# EAGLE schematic Filters_3Stage_Circuit_Manual (EAGLE 9.3.0)
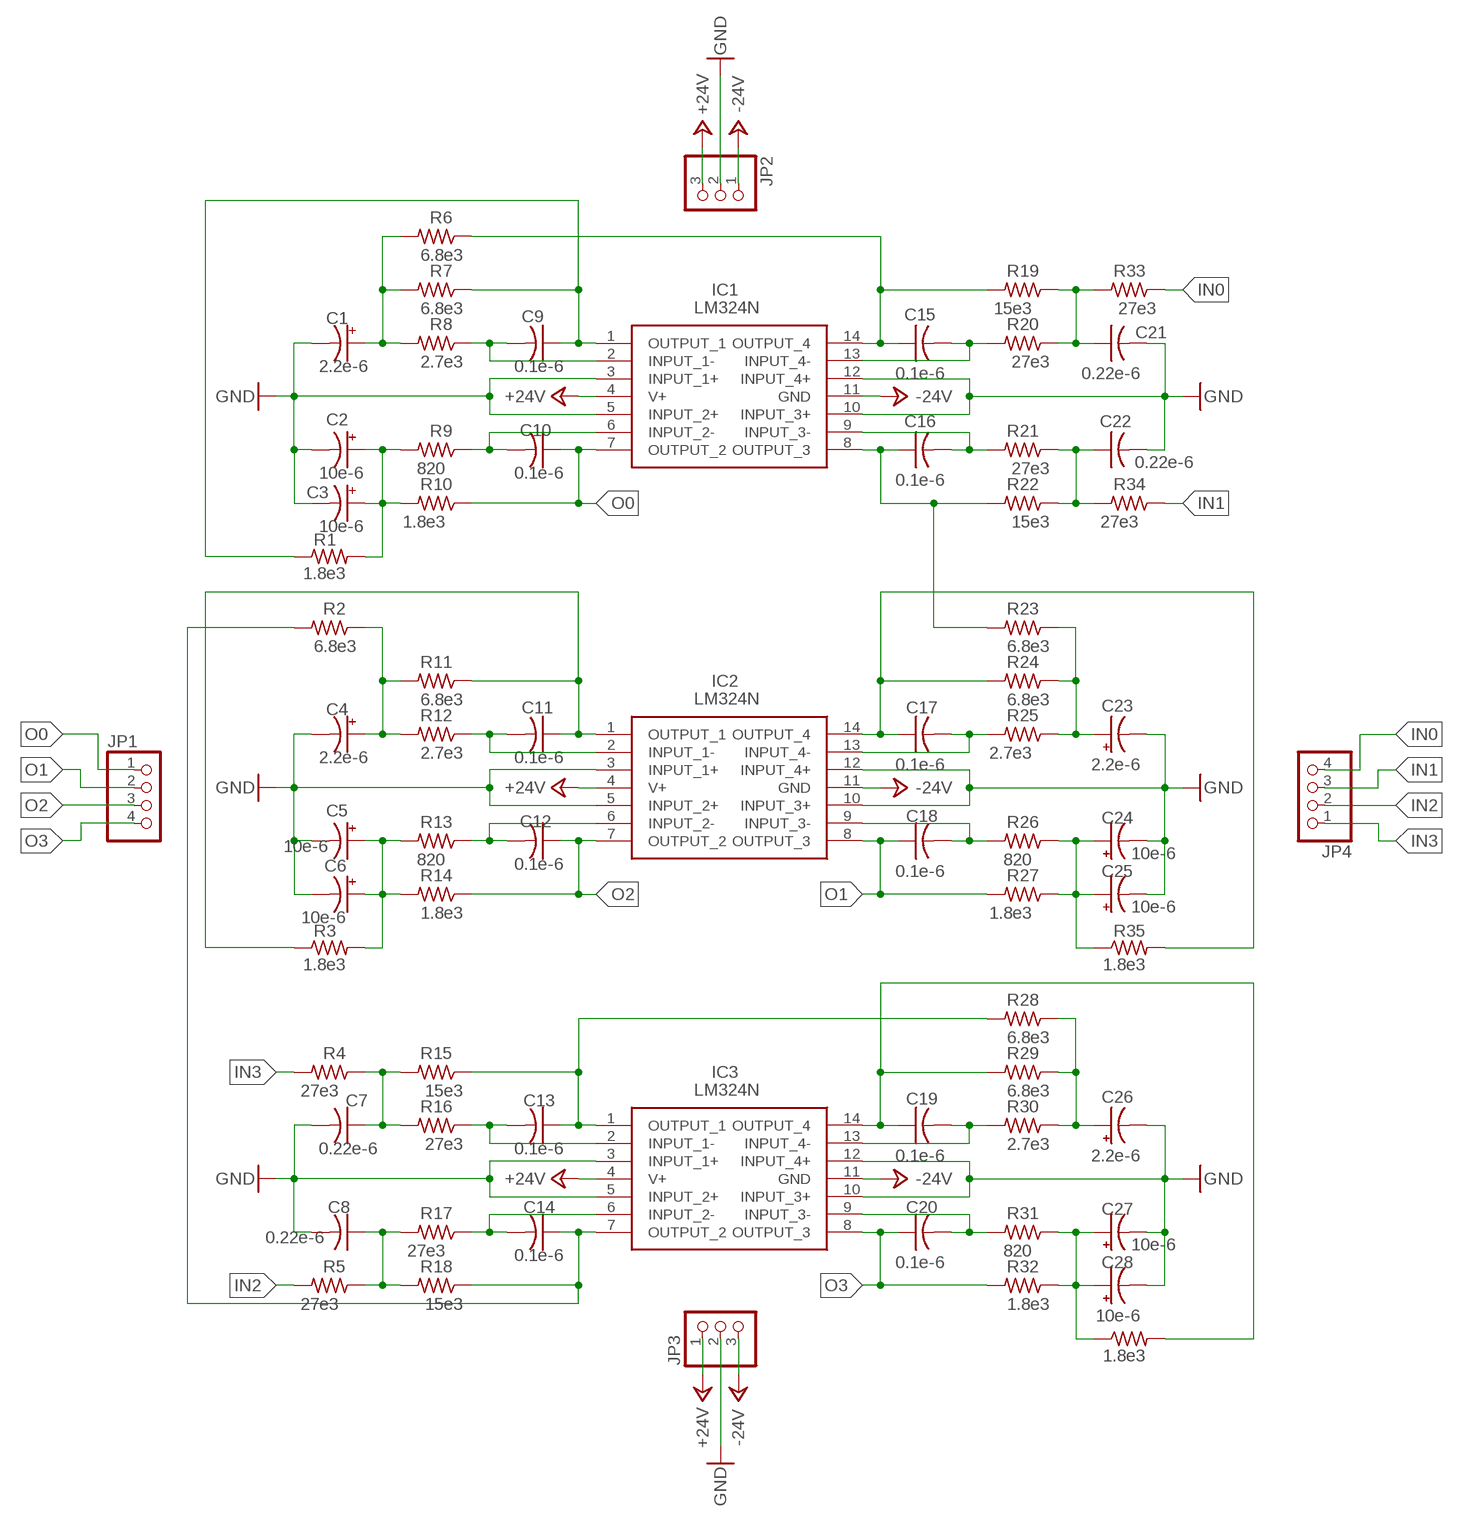
[diagram p0: schematic, sheet 1]

## Parts
C1  2.2e-6  CPOL-USE2.5-5  [E2,5-5]
C2  10e-6  CPOL-USE2.5-7  [E2,5-7]
C3  10e-6  CPOL-USE2.5-7  [E2,5-7]
C4  2.2e-6  CPOL-USE2.5-5  [E2,5-5]
C5  10e-6  CPOL-USE2.5-7  [E2,5-7]
C6  10e-6  CPOL-USE2.5-7  [E2,5-7]
C7  0.22e-6  C-US050-030X075  [C050-030X075]
C8  0.22e-6  C-US050-030X075  [C050-030X075]
C9  0.1e-6  C-US050-030X075  [C050-030X075]
C10  0.1e-6  C-US050-030X075  [C050-030X075]
C11  0.1e-6  C-US050-030X075  [C050-030X075]
C12  0.1e-6  C-US050-030X075  [C050-030X075]
C13  0.1e-6  C-US050-030X075  [C050-030X075]
C14  0.1e-6  C-US050-030X075  [C050-030X075]
C15  0.1e-6  C-US050-030X075  [C050-030X075]
C16  0.1e-6  C-US050-030X075  [C050-030X075]
C17  0.1e-6  C-US050-030X075  [C050-030X075]
C18  0.1e-6  C-US050-030X075  [C050-030X075]
C19  0.1e-6  C-US050-030X075  [C050-030X075]
C20  0.1e-6  C-US050-030X075  [C050-030X075]
C21  0.22e-6  C-US050-030X075  [C050-030X075]
C22  0.22e-6  C-US050-030X075  [C050-030X075]
C23  2.2e-6  CPOL-USE2.5-5  [E2,5-5]
C24  10e-6  CPOL-USE2.5-7  [E2,5-7]
C25  10e-6  CPOL-USE2.5-7  [E2,5-7]
C26  2.2e-6  CPOL-USE2.5-5  [E2,5-5]
C27  10e-6  CPOL-USE2.5-7  [E2,5-7]
C28  10e-6  CPOL-USE2.5-7  [E2,5-7]
IC1  LM324N  [DIP794W56P254L1905H533Q14N]
IC2  LM324N  [DIP794W56P254L1905H533Q14N]
IC3  LM324N  [DIP794W56P254L1905H533Q14N]
JP1  PINHD-1X4  [1X04]
JP2  PINHD-1X3  [1X03]
JP3  PINHD-1X3  [1X03]
JP4  PINHD-1X4  [1X04]
R1  1.8e3  R-US_0207/10  [0207/10]
R2  6.8e3  R-US_0207/10  [0207/10]
R3  1.8e3  R-US_0207/10  [0207/10]
R4  27e3  R-US_0207/10  [0207/10]
R5  27e3  R-US_0207/10  [0207/10]
R6  6.8e3  R-US_0207/10  [0207/10]
R7  6.8e3  R-US_0207/10  [0207/10]
R8  2.7e3  R-US_0207/10  [0207/10]
R9  820  R-US_0207/10  [0207/10]
R10  1.8e3  R-US_0207/10  [0207/10]
R11  6.8e3  R-US_0207/10  [0207/10]
R12  2.7e3  R-US_0207/10  [0207/10]
R13  820  R-US_0207/10  [0207/10]
R14  1.8e3  R-US_0207/10  [0207/10]
R15  15e3  R-US_0207/10  [0207/10]
R16  27e3  R-US_0207/10  [0207/10]
R17  27e3  R-US_0207/10  [0207/10]
R18  15e3  R-US_0207/10  [0207/10]
R19  15e3  R-US_0207/10  [0207/10]
R20  27e3  R-US_0207/10  [0207/10]
R21  27e3  R-US_0207/10  [0207/10]
R22  15e3  R-US_0207/10  [0207/10]
R23  6.8e3  R-US_0207/10  [0207/10]
R24  6.8e3  R-US_0207/10  [0207/10]
R25  2.7e3  R-US_0207/10  [0207/10]
R26  820  R-US_0207/10  [0207/10]
R27  1.8e3  R-US_0207/10  [0207/10]
R28  6.8e3  R-US_0207/10  [0207/10]
R29  6.8e3  R-US_0207/10  [0207/10]
R30  2.7e3  R-US_0207/10  [0207/10]
R31  820  R-US_0207/10  [0207/10]
R32  1.8e3  R-US_0207/10  [0207/10]
R33  27e3  R-US_0207/10  [0207/10]
R34  27e3  R-US_0207/10  [0207/10]
R35  1.8e3  R-US_0207/10  [0207/10]
R36  1.8e3  R-US_0207/10  [0207/10]

## Nets
+24V: IC1.4(V+) IC2.4(V+) IC3.4(V+) JP2.3 JP3.1
-24V: IC1.11(GND) IC2.11(GND) IC3.11(GND) JP2.1 JP3.3
GND: C1.- C2.- C3.- C4.- C5.- C6.- C7.2 C8.2 C21.2 C22.2 C23.- C24.- C25.- C26.- C27.- C28.- IC1.3(INPUT_1+) IC1.5(INPUT_2+) IC1.10(INPUT_3+) IC1.12(INPUT_4+) IC2.3(INPUT_1+) IC2.5(INPUT_2+) IC2.10(INPUT_3+) IC2.12(INPUT_4+) IC3.3(INPUT_1+) IC3.5(INPUT_2+) IC3.10(INPUT_3+) IC3.12(INPUT_4+) JP2.2 JP3.2
IN0: JP4.4 R33.1
IN1: JP4.3 R34.1
IN2: JP4.2 R5.2
IN3: JP4.1 R4.2
N$216: C15.1 IC1.14(OUTPUT_4) R6.1 R19.2
N$217: C15.2 IC1.13(INPUT_4-) R20.2
N$218: C21.1 R19.1 R20.1 R33.2
N$219: C9.1 IC1.1(OUTPUT_1) R1.1 R7.1
N$221: C9.2 IC1.2(INPUT_1-) R8.1
N$223: C10.2 IC1.6(INPUT_2-) R9.1
N$224: C1.+ R6.2 R7.2 R8.2
N$225: C2.+ C3.+ R1.2 R9.2 R10.2
N$226: C16.1 IC1.8(OUTPUT_3) R22.2 R23.2
N$227: C16.2 IC1.9(INPUT_3-) R21.2
N$228: C22.1 R21.1 R22.1 R34.2
N$229: C17.1 IC2.14(OUTPUT_4) R24.2 R35.2
N$230: C17.2 IC2.13(INPUT_4-) R25.2
N$231: C23.+ R23.1 R24.1 R25.1
N$234: C11.1 IC2.1(OUTPUT_1) R3.1 R11.1
N$235: C11.2 IC2.2(INPUT_1-) R12.1
N$236: C4.+ R2.1 R11.2 R12.2
N$238: C12.2 IC2.6(INPUT_2-) R13.1
N$239: C5.+ C6.+ R3.2 R13.2 R14.2
N$240: C18.2 IC2.9(INPUT_3-) R26.2
N$241: C24.+ C25.+ R26.1 R27.1 R35.1
N$243: C13.2 IC3.2(INPUT_1-) R16.1
N$244: C14.1 IC3.7(OUTPUT_2) R2.2 R18.1
N$245: C14.2 IC3.6(INPUT_2-) R17.1
N$246: C7.1 R4.1 R15.2 R16.2
N$249: C8.1 R5.1 R17.2 R18.2
N$250: C13.1 IC3.1(OUTPUT_1) R15.1 R28.2
N$251: C19.1 IC3.14(OUTPUT_4) R29.2 R36.2
N$252: C19.2 IC3.13(INPUT_4-) R30.2
N$253: C26.+ R28.1 R29.1 R30.1
N$255: C20.2 IC3.9(INPUT_3-) R31.2
N$256: C27.+ C28.+ R31.1 R32.1 R36.1
O0: C10.1 IC1.7(OUTPUT_2) JP1.1 R10.1
O1: C18.1 IC2.8(OUTPUT_3) JP1.2 R27.2
O2: C12.1 IC2.7(OUTPUT_2) JP1.3 R14.1
O3: C20.1 IC3.8(OUTPUT_3) JP1.4 R32.2

## Library data of the parts
C1-C6 C23-C28 = rcl:CPOL-US: POLARIZED CAPACITOR, American symbol; SPICEPREFIX: C
C7-C22 = adafruit:C-US: CAPACITOR, American symbol
IC1-IC3 = SamacSys_Parts:LM324N: OP Amp Quad GP 16V/32V 14-Pin PDIP Texas Instruments LM324N, Quad Op Amp, 1.2MHz, 5 28 V, 14-Pin PDIP Source: Datasheet <http://www.ti.com/lit/ds/symlink/lm324-n.pdf>; DESCRIPTION: OP Amp Quad GP 16V/32V 14-Pin PDIP Texas Instruments LM324N, Quad Op Amp, 1.2MHz, 5 28 V, 14-Pin PDIP; HEIGHT: 5.334mm; MANUFACTURER_NAME: Texas Instruments; MANUFACTURER_PART_NUMBER: LM324N; MOUSER_PART_NUMBER: 595-LM324N
JP1 JP4 = pinhead:PINHD-1X4: PIN HEADER
JP2 JP3 = pinhead:PINHD-1X3: PIN HEADER
R1-R36 = rcl:R-US_: RESISTOR, American symbol; SPICEPREFIX: R

## Net classes
0 default: width 0.305 mm, drill 0.508 mm, clearance 0.254 mm